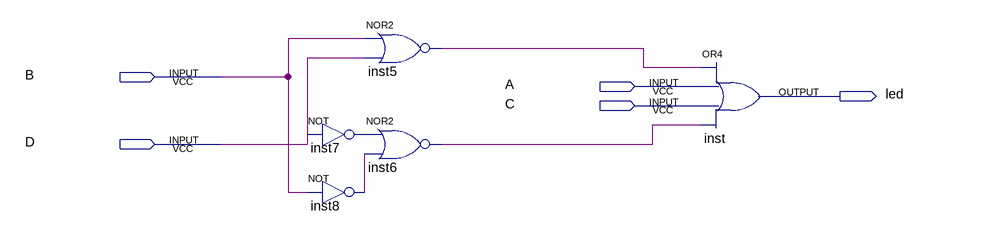
[diagram p0: schematic sheet]
// Quartus schematic projetos.bdf as structural Verilog: 5 symbols, 5 pins
module projetos (
  input  B,
  input  A,
  input  C,
  input  D,
  output led
);

  wire inst5_out, inst6_out, inst7_out, inst8_out;

  not inst7 (inst7_out, D);
  not inst8 (inst8_out, B);
  nor inst5 (inst5_out, B, D);
  nor inst6 (inst6_out, inst7_out, inst8_out);
  or inst (led, inst5_out, A, C, inst6_out);
endmodule
